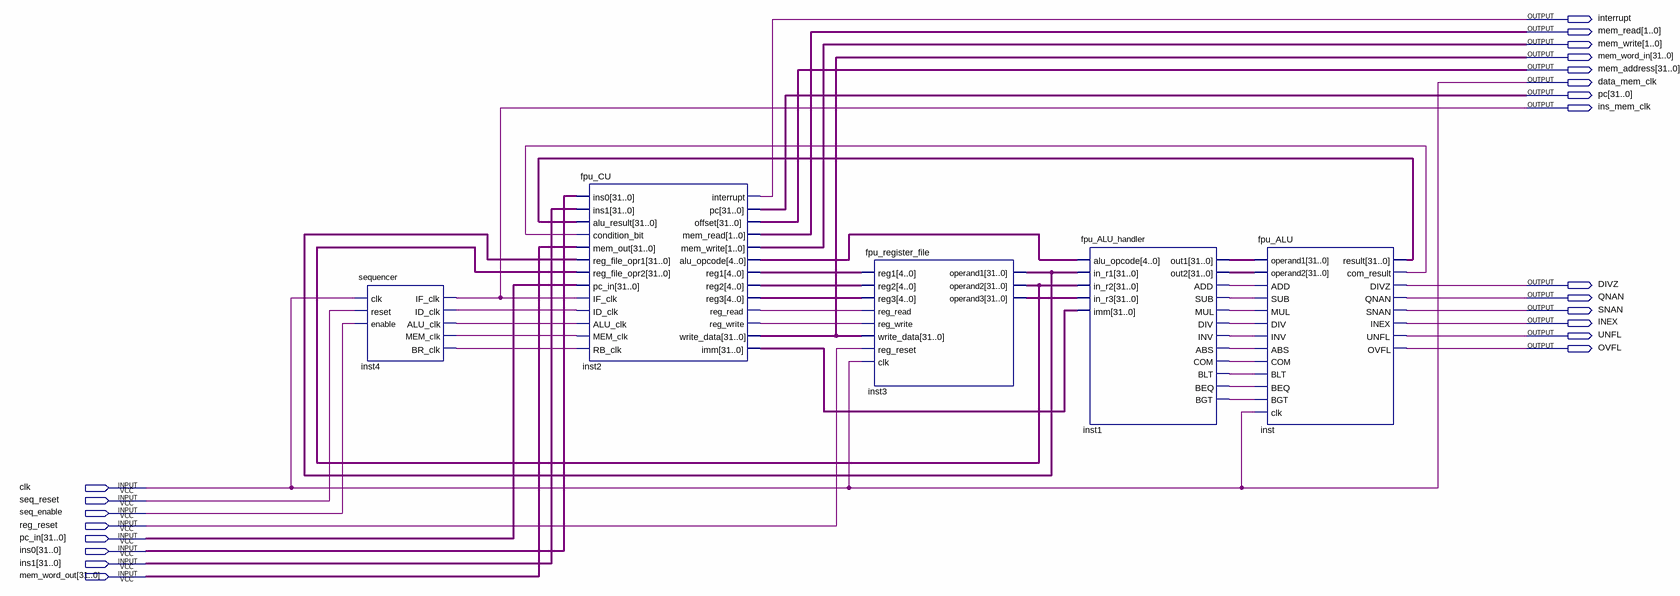
[diagram p0: schematic sheet]
// Quartus schematic FPU.bdf as structural Verilog: 5 symbols, 22 pins
module FPU (
  input  clk,
  input  seq_reset,
  input  seq_enable,
  input  reg_reset,
  input  [31:0] pc_in,
  input  [31:0] ins0,
  input  [31:0] ins1,
  input  [31:0] mem_word_out,
  output interrupt,
  output [1:0] mem_read,
  output [1:0] mem_write,
  output [31:0] mem_word_in,
  output [31:0] mem_address,
  output data_mem_clk,
  output [31:0] pc,
  output ins_mem_clk,
  output DIVZ,
  output QNAN,
  output SNAN,
  output INEX,
  output UNFL,
  output OVFL
);

  wire inst1_abs, inst1_add, inst1_beq, inst1_bgt, inst1_blt, inst1_com, inst1_div, inst1_inv, inst1_mul,
       inst1_sub, inst2_reg_read, inst2_reg_write, inst4_alu_clk, inst4_br_clk, inst4_id_clk, inst4_mem_clk,
       inst_com_result;
  wire [4:0] inst2_alu_opcode, inst2_reg1, inst2_reg2, inst2_reg3;
  wire [31:0] inst1_out1, inst1_out2, inst2_imm, inst3_operand1, inst3_operand2, inst3_operand3, inst_result;

  sequencer inst4 (
    .clk(clk), .reset(seq_reset), .enable(seq_enable), .IF_clk(ins_mem_clk), .ID_clk(inst4_id_clk),
    .ALU_clk(inst4_alu_clk), .MEM_clk(inst4_mem_clk), .BR_clk(inst4_br_clk));
  fpu_CU inst2 (
    .ins0(ins0), .ins1(ins1), .alu_result(inst_result), .condition_bit(inst_com_result),
    .mem_out(mem_word_out), .reg_file_opr1(inst3_operand1), .reg_file_opr2(inst3_operand2), .pc_in(pc_in),
    .IF_clk(ins_mem_clk), .ID_clk(inst4_id_clk), .ALU_clk(inst4_alu_clk), .MEM_clk(inst4_mem_clk),
    .RB_clk(inst4_br_clk), .interrupt(interrupt), .pc(pc), .offset(mem_address), .mem_read(mem_read),
    .mem_write(mem_write), .alu_opcode(inst2_alu_opcode), .reg1(inst2_reg1), .reg2(inst2_reg2),
    .reg3(inst2_reg3), .reg_read(inst2_reg_read), .reg_write(inst2_reg_write), .write_data(mem_word_in),
    .imm(inst2_imm));
  fpu_register_file inst3 (
    .reg1(inst2_reg1), .reg2(inst2_reg2), .reg3(inst2_reg3), .reg_read(inst2_reg_read),
    .reg_write(inst2_reg_write), .write_data(mem_word_in), .reg_reset(reg_reset), .clk(clk),
    .operand1(inst3_operand1), .operand2(inst3_operand2), .operand3(inst3_operand3));
  fpu_ALU_handler inst1 (
    .alu_opcode(inst2_alu_opcode), .in_r1(inst3_operand1), .in_r2(inst3_operand2), .in_r3(inst3_operand3),
    .imm(inst2_imm), .out1(inst1_out1), .out2(inst1_out2), .ADD(inst1_add), .SUB(inst1_sub), .MUL(inst1_mul),
    .DIV(inst1_div), .INV(inst1_inv), .ABS(inst1_abs), .COM(inst1_com), .BLT(inst1_blt), .BEQ(inst1_beq),
    .BGT(inst1_bgt));
  fpu_ALU inst (
    .operand1(inst1_out1), .operand2(inst1_out2), .ADD(inst1_add), .SUB(inst1_sub), .MUL(inst1_mul),
    .DIV(inst1_div), .INV(inst1_inv), .ABS(inst1_abs), .COM(inst1_com), .BLT(inst1_blt), .BEQ(inst1_beq),
    .BGT(inst1_bgt), .clk(clk), .result(inst_result), .com_result(inst_com_result), .DIVZ(DIVZ), .QNAN(QNAN),
    .SNAN(SNAN), .INEX(INEX), .UNFL(UNFL), .OVFL(OVFL));

  assign data_mem_clk = clk;
endmodule
